# Altium project Adaptor_Board.PrjPcb
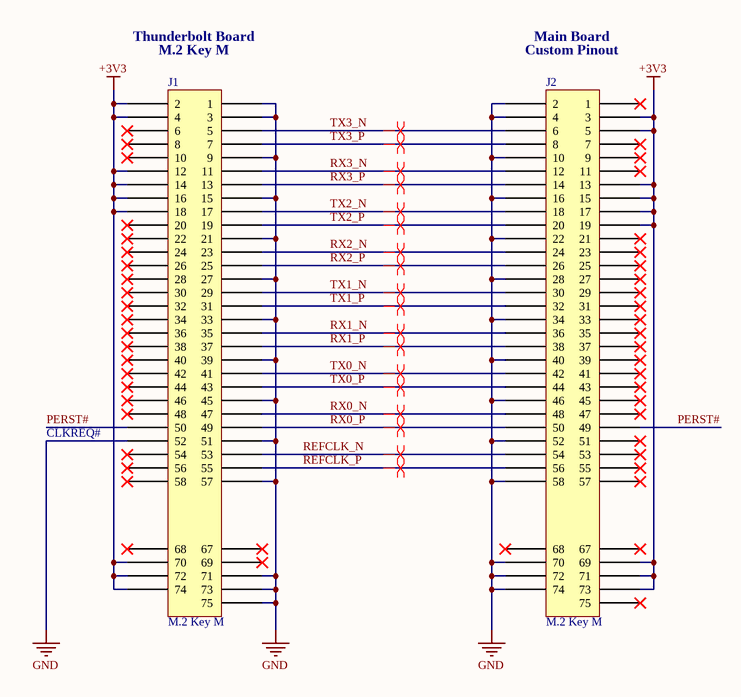
[diagram p0: Main.SchDoc]
1 sheet, 2 parts. Net scope: global (net labels, ports and power ports of the same name join across sheets).
Board file: Adaptor_Board.PcbDoc

## Sheet Main.SchDoc
size A4; SheetNumber: 1; SheetTotal: 1

### Parts
J1  M.2 Key M  [PCB EDGE M.2 Key M]
J2  M.2 Key M  [PCB EDGE M.2 Key M]

### Nets
+3V3: J1.2 J1.4 J1.12 J1.14 J1.16 J1.18 J1.70 J1.72 J1.74 J2.3 J2.5 J2.13 J2.15 J2.17 J2.19 J2.69 J2.71 J2.73
GND: J1.1 J1.3 J1.9 J1.15 J1.21 J1.27 J1.33 J1.39 J1.45 J1.51 J1.52 J1.57 J1.71 J1.73 J1.75 J2.2 J2.4 J2.10 J2.16 J2.22 J2.28 J2.34 J2.40 J2.46 J2.52 J2.58 J2.70 J2.72 J2.74
PERST#: J1.50 J2.49
REFCLK_N: J1.53 J2.54
REFCLK_P: J1.55 J2.56
RX0_N: J1.47 J2.48
RX0_P: J1.49 J2.50
RX1_N: J1.35 J2.36
RX1_P: J1.37 J2.38
RX2_N: J1.23 J2.24
RX2_P: J1.25 J2.26
RX3_N: J1.11 J2.12
RX3_P: J1.13 J2.14
TX0_N: J1.41 J2.42
TX0_P: J1.43 J2.44
TX1_N: J1.29 J2.30
TX1_P: J1.31 J2.32
TX2_N: J1.17 J2.18
TX2_P: J1.19 J2.20
TX3_N: J1.5 J2.6
TX3_P: J1.7 J2.8

Not connected (* = marked no-connect by the designer): J1 6* 8* 10* 20* 22* 24* 26* 28* 30* 32* 34* 36* 38* 40* 42* 44* 46* 48* 54* 56* 58* 67* 68* 69*; J2 1* 7* 9* 11* 21* 23* 25* 27* 29* 31* 33* 35* 37* 39* 41* 43* 45* 47* 51* 53* 55* 57* 67* 68* 75*

### Layout directives
differential pair; differential pair class PCIe: REFCLK_N, REFCLK_P, RX0_N, RX0_P, RX1_N, RX1_P, RX2_N, RX2_P, RX3_N, RX3_P, TX0_N, TX0_P, TX1_N, TX1_P, TX2_N, TX2_P, TX3_N, TX3_P

### Notes on the sheet
- Thunderbolt Board
- (near J1) M.2 Key M
- Main Board
- (near J2) Custom Pinout
- CLKREQ#